# Altium project sinking-clock_Brain-PCB_RigFlex-testPrjPcb.PrjPcb
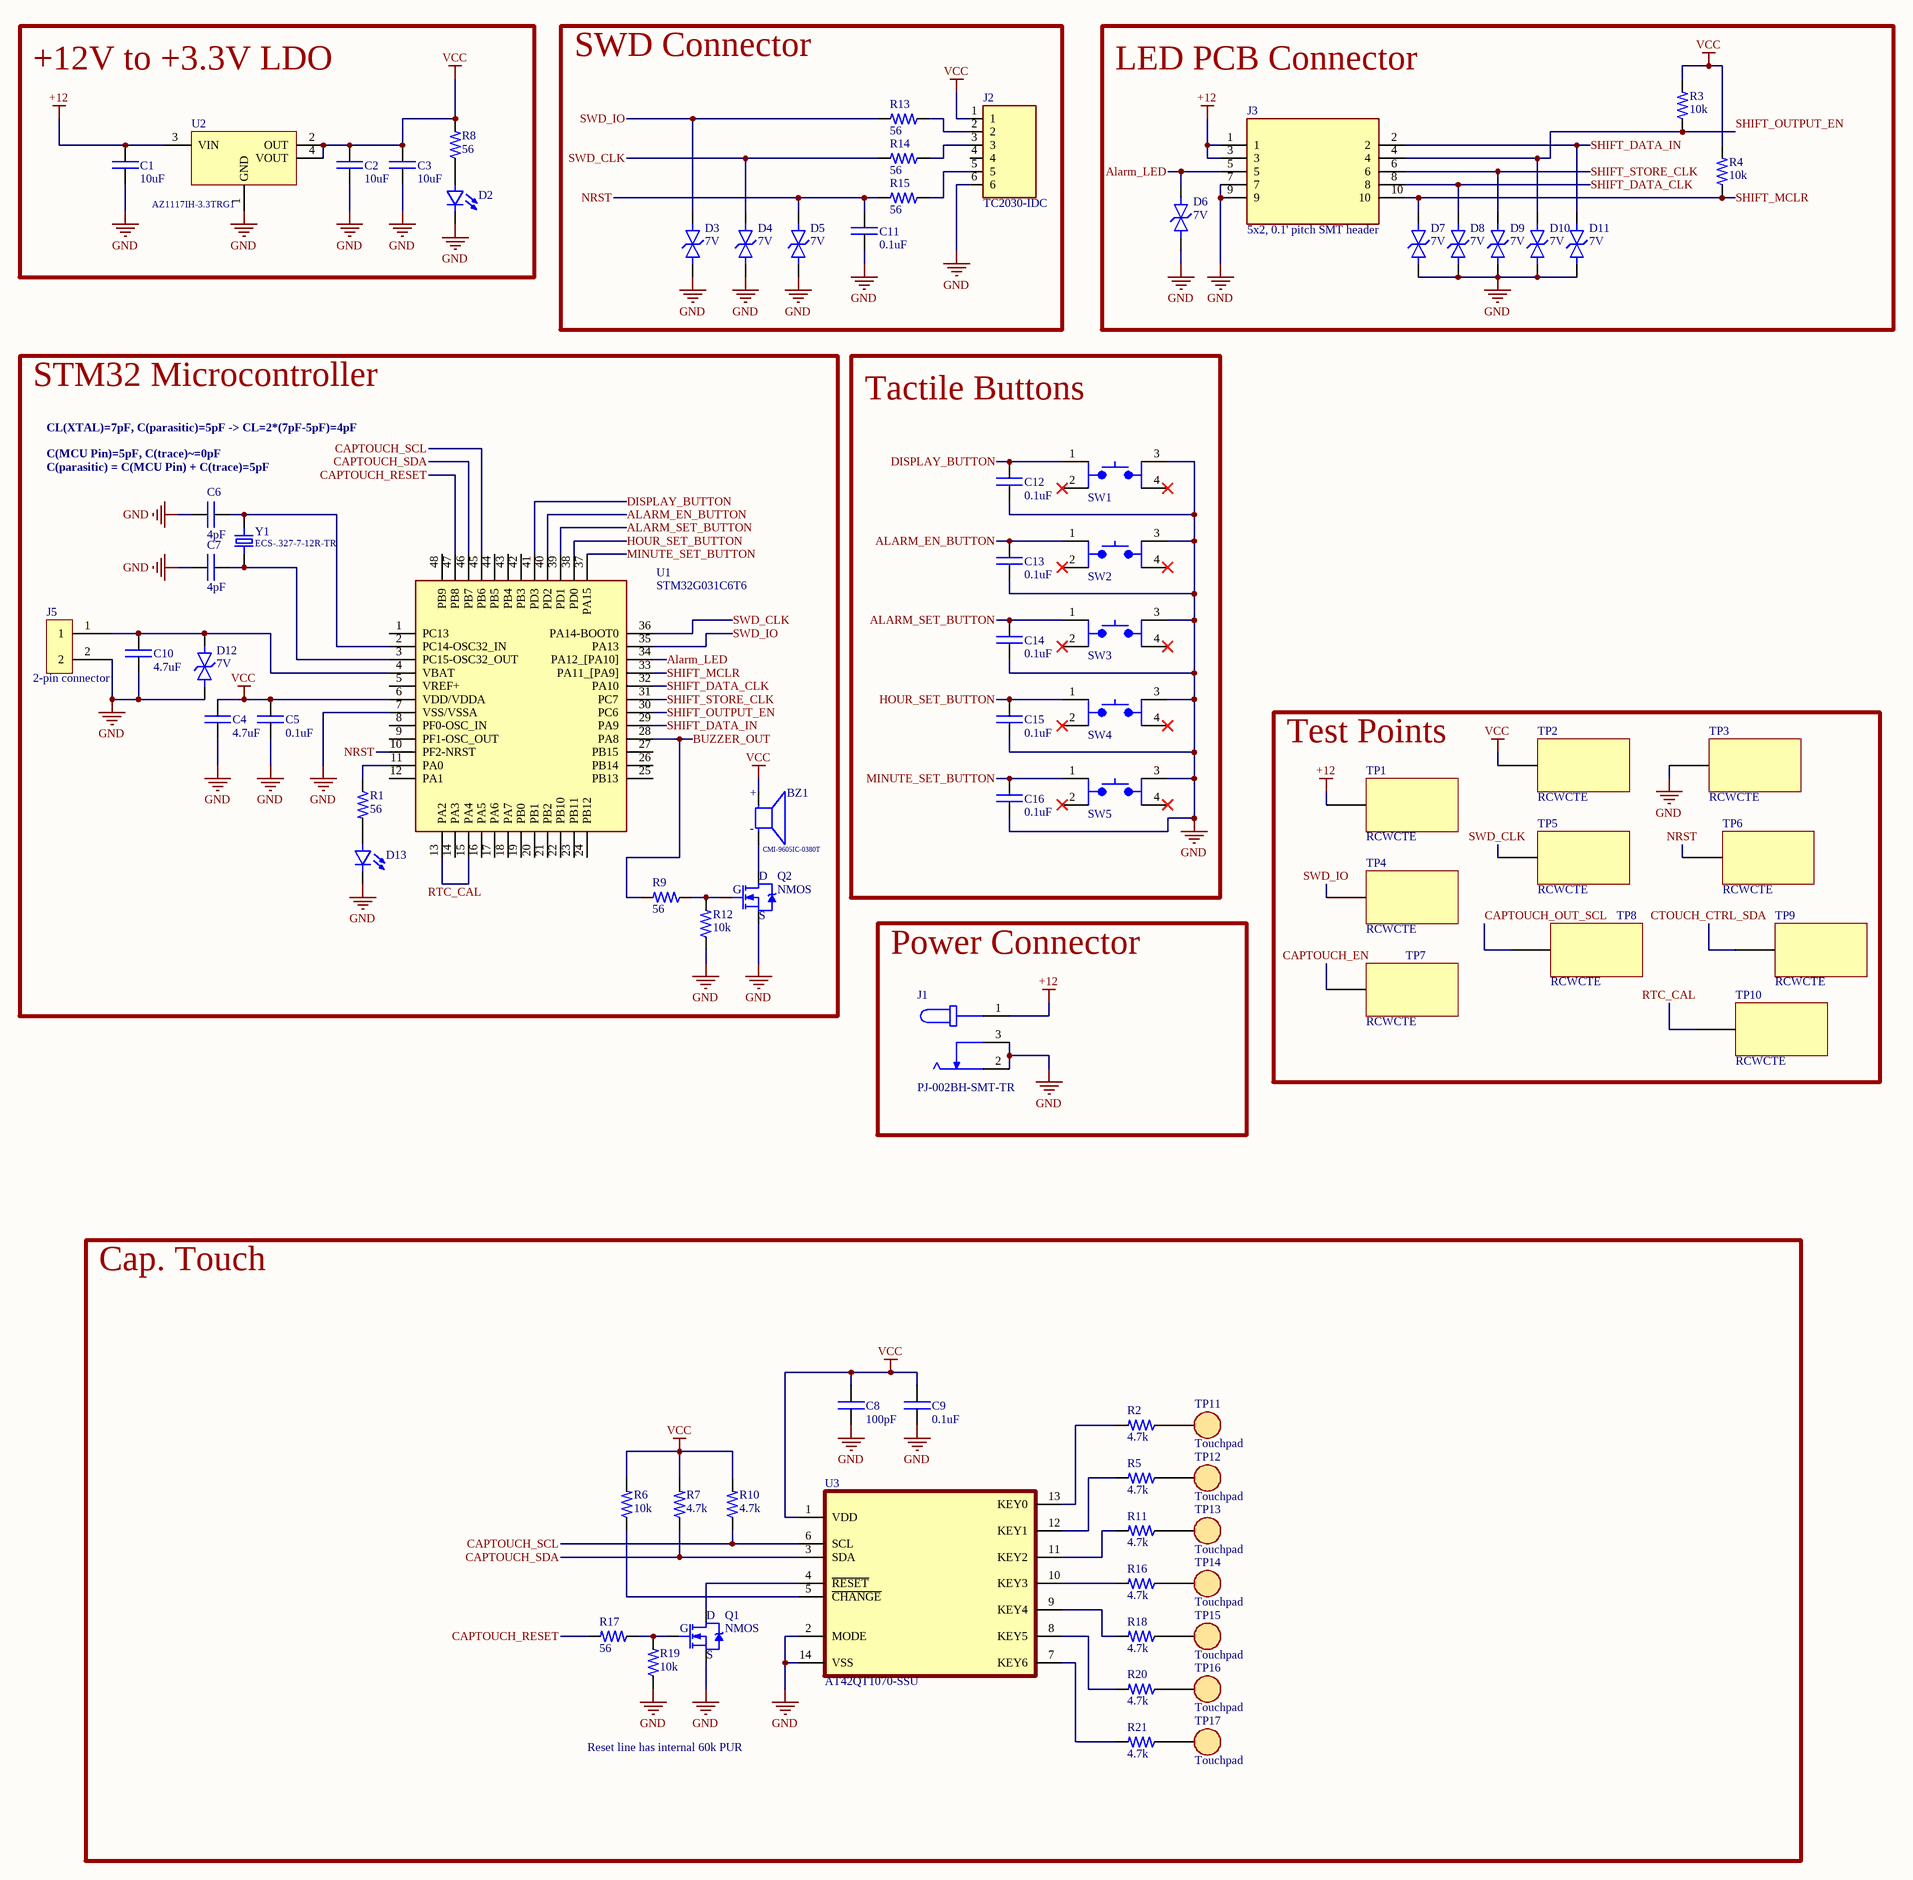
[diagram p0: Brain-PCB_Master_RigFlex-test.SchDoc]
1 sheet, 82 parts. Net scope: global (net labels, ports and power ports of the same name join across sheets).
Board file: sinking-clock_Brain-PCB_RigFlex-test.PcbDoc

## Sheet Brain-PCB_Master_RigFlex-test.SchDoc
size C; SheetNumber: 1; SheetTotal: 1

### Parts
BZ1  CMI-9605IC-0380T  [CUI_CMI-9605IC-0380T]
C1  value 10uF  [0402C]  (hidden comment: CAP)
C2  value 10uF  [0402C]  (hidden comment: CAP)
C3  value 10uF  [0402C]  (hidden comment: CAP)
C4  value 4.7uF  [0402C]  (hidden comment: CAP)
C5  value 0.1uF  [0402C]  (hidden comment: CAP)
C6  value 4pF  [0402C]  (hidden comment: CAP)
C7  value 4pF  [0402C]  (hidden comment: CAP)
C8  value 100pF  [0402C]  (hidden comment: CAP)
C9  value 0.1uF  [0402C]  (hidden comment: CAP)
C10  value 4.7uF  [0402C]  (hidden comment: CAP)
C11  value 0.1uF  [0402C]  (hidden comment: CAP)
C12  value 0.1uF  [0402C]  (hidden comment: CAP)
C13  value 0.1uF  [0402C]  (hidden comment: CAP)
C14  value 0.1uF  [0402C]  (hidden comment: CAP)
C15  value 0.1uF  [0402C]  (hidden comment: CAP)
C16  value 0.1uF  [0402C]  (hidden comment: CAP)
D2  LED - single  [LED - 0603]  (value not drawn)
D3  7V  [DESD3V3S1BL-7B]
D4  7V  [DESD3V3S1BL-7B]
D5  7V  [DESD3V3S1BL-7B]
D6  7V  [DESD3V3S1BL-7B]
D7  7V  [DESD3V3S1BL-7B]
D8  7V  [DESD3V3S1BL-7B]
D9  7V  [DESD3V3S1BL-7B]
D10  7V  [DESD3V3S1BL-7B]
D11  7V  [DESD3V3S1BL-7B]
D12  7V  [DESD3V3S1BL-7B]
D13  LED - single  [LED - 0603]  (value not drawn)
J1  PJ-002BH-SMT-TR  [PJ-002BH-SMT-TR]
J2  TC2030-IDC  [TAG CONNECT TC2030IDC - NO 3D MODEL]
J3  5x2, 0.1' pitch SMT header  [5x2, 0.1' pitch SMT header]
J5  2-pin connector  [2-pos, 0.1" TH header]
Q1  NMOS  [SOT-23]
Q2  NMOS  [SOT-23]
R1  value 56  [0402R]  (hidden comment: RES)
R2  value 4.7k  [0402R]  (hidden comment: RES)
R3  value 10k  [0402R]  (hidden comment: RES)
R4  value 10k  [0402R]  (hidden comment: RES)
R5  value 4.7k  [0402R]  (hidden comment: RES)
R6  value 10k  [0402R]  (hidden comment: RES)
R7  value 4.7k  [0402R]  (hidden comment: RES)
R8  value 56  [0402R]  (hidden comment: RES)
R9  value 56  [0402R]  (hidden comment: RES)
R10  value 4.7k  [0402R]  (hidden comment: RES)
R11  value 4.7k  [0402R]  (hidden comment: RES)
R12  value 10k  [0402R]  (hidden comment: RES)
R13  value 56  [0402R]  (hidden comment: RES)
R14  value 56  [0402R]  (hidden comment: RES)
R15  value 56  [0402R]  (hidden comment: RES)
R16  value 4.7k  [0402R]  (hidden comment: RES)
R17  value 56  [0402R]  (hidden comment: RES)
R18  value 4.7k  [0402R]  (hidden comment: RES)
R19  value 10k  [0402R]  (hidden comment: RES)
R20  value 4.7k  [0402R]  (hidden comment: RES)
R21  value 4.7k  [0402R]  (hidden comment: RES)
SW1  SPDT SMT Tactile Push Button Switch  [TL3301BF160QGTUBE]  (value not drawn)
SW2  SPDT SMT Tactile Push Button Switch  [TL3301BF160QGTUBE]  (value not drawn)
SW3  SPDT SMT Tactile Push Button Switch  [TL3301BF160QGTUBE]  (value not drawn)
SW4  SPDT SMT Tactile Push Button Switch  [TL3301BF160QGTUBE]  (value not drawn)
SW5  SPDT SMT Tactile Push Button Switch  [TL3301BF160QGTUBE]  (value not drawn)
TP1  RCWCTE  [RCWCTE]
TP2  RCWCTE  [RCWCTE]
TP3  RCWCTE  [RCWCTE]
TP4  RCWCTE  [RCWCTE]
TP5  RCWCTE  [RCWCTE]
TP6  RCWCTE  [RCWCTE]
TP7  RCWCTE  [RCWCTE]
TP8  RCWCTE  [RCWCTE]
TP9  RCWCTE  [RCWCTE]
TP10  RCWCTE  [RCWCTE]
TP11  Touchpad
TP12  Touchpad
TP13  Touchpad
TP14  Touchpad
TP15  Touchpad
TP16  Touchpad
TP17  Touchpad
U1  STM32G031C6T6  [48-LQFP]
U2  AZ1117IH-3.3TRG1  [SOT-223-3]
U3  AT42QT1070-SSU  [14-SOIC]
Y1  ECS-.327-7-12R-TR  [ECS-.327-12.5-12R-TR]

### Blocks framed on the sheet
+12V to +3.3V LDO: C1-C3 D2 R8 U2
SWD Connector: C11 D3-D5 J2 R13-R15
LED PCB Connector: D6-D11 J3 R3 R4
STM32 Microcontroller: BZ1 C4-C7 C10 D12 D13 J5 Q2 R1 R9 R12 U1 Y1
Tactile Buttons: C12-C16 SW1-SW5
Test Points: TP1-TP10
Power Connector: J1
Cap. Touch: C8 C9 Q1 R2 R5-R7 R10 R11 R16-R21 TP11-TP17 U3

### Nets
+12: C1.2 J1.1 J3.1 J3.3 TP1.1 U2.3(VIN)
GND: C1.1 C2.1 C3.1 C4.1 C5.1 C6.1 C7.1 C8.1 C9.1 C10.1 C11.1 C12.1 C13.1 C14.1 C15.1 C16.1 D2.2(C) D3.2 D4.2 D5.2 D6.2 D7.2 D8.2 D9.2 D10.2 D11.2 D12.2 D13.2(C) J1.2 J1.3 J2.6 J3.7 J3.9 J5.2 Q1.2(S) Q2.2(S) R12.1 R19.1 SW1.3 SW2.3 SW3.3 SW4.3 SW5.3 TP3.1 U1.7(VSS/VSSA) U2.1(GND) U3.2(MODE) U3.14(VSS)
VCC: BZ1.P C2.2 C3.2 C4.2 C5.2 C8.2 C9.2 J2.1 R3.2 R4.2 R6.2 R7.2 R8.2 R10.2 TP2.1 U1.6(VDD/VDDA) U2.2(OUT) U2.4(VOUT) U3.1(VDD)
ALARM_EN_BUTTON: C13.2 SW2.1 U1.40(PD2)
Alarm_LED: D6.1 J3.5 U1.34(PA12_[PA10])
ALARM_SET_BUTTON: C14.2 SW3.1 U1.39(PD1)
BUZZER_OUT: R9.2 U1.28(PA8)
CAPTOUCH_EN: TP7.1
CAPTOUCH_OUT_SCL: TP8.1
CAPTOUCH_RESET: R17.2 U1.47(PB8)
CAPTOUCH_SCL: R10.1 U1.45(PB6) U3.6(SCL)
CAPTOUCH_SDA: R7.1 U1.46(PB7) U3.3(SDA)
CTOUCH_CTRL_SDA: TP9.1
DISPLAY_BUTTON: C12.2 SW1.1 U1.41(PD3)
HOUR_SET_BUTTON: C15.2 SW4.1 U1.38(PD0)
MINUTE_SET_BUTTON: C16.2 SW5.1 U1.37(PA15)
NRST: C11.2 D5.1 R15.2 TP6.1 U1.10(PF2-NRST)
RTC_CAL: TP10.1 U1.13(PA2) U1.15(PA4)
SHIFT_DATA_CLK: D8.1 J3.8 U1.32(PA10)
SHIFT_DATA_IN: D11.1 J3.2 U1.29(PA9)
SHIFT_MCLR: D7.1 J3.10 R4.1 U1.33(PA11_[PA9])
SHIFT_OUTPUT_EN: D10.1 J3.4 R3.1 U1.30(PC6)
SHIFT_STORE_CLK: D9.1 J3.6 U1.31(PC7)
SWD_CLK: D4.1 R14.2 TP5.1 U1.36(PA14-BOOT0)
SWD_IO: D3.1 R13.2 TP4.1 U1.35(PA13)
NetBZ1_N: BZ1.N Q2.3(D)
NetC6_2: C6.2 U1.2(PC14-OSC32_IN) Y1.2
NetC7_2: C7.2 U1.3(PC15-OSC32_OUT) Y1.1
NetC10_2: C10.2 D12.1 J5.1 U1.4(VBAT)
NetD2_1: D2.1(A) R8.1
NetD13_1: D13.1(A) R1.2
NetJ2_2: J2.2 R13.1
NetJ2_3: J2.3 R14.1
NetJ2_5: J2.5 R15.1
NetQ1_1: Q1.1(G) R17.1 R19.2
NetQ1_3: Q1.3(D) U3.4(~{RESET})
NetQ2_1: Q2.1(G) R9.1 R12.2
NetR1_1: R1.1 U1.11(PA0)
NetR2_1: R2.1 TP11.1
NetR2_2: R2.2 U3.13(KEY0)
NetR5_1: R5.1 TP12.1
NetR5_2: R5.2 U3.12(KEY1)
NetR6_1: R6.1 U3.5(~{CHANGE})
NetR11_1: R11.1 TP13.1
NetR11_2: R11.2 U3.11(KEY2)
NetR16_1: R16.1 TP14.1
NetR16_2: R16.2 U3.10(KEY3)
NetR18_1: R18.1 TP15.1
NetR18_2: R18.2 U3.9(KEY4)
NetR20_1: R20.1 TP16.1
NetR20_2: R20.2 U3.8(KEY5)
NetR21_1: R21.1 TP17.1
NetR21_2: R21.2 U3.7(KEY6)

Not connected (* = marked no-connect by the designer): J2 4; SW1 2* 4*; SW2 2* 4*; SW3 2* 4*; SW4 2* 4*; SW5 2* 4*; U1 1(PC13) 5(VREF+) 8(PF0-OSC_IN) 9(PF1-OSC_OUT) 12(PA1) 14(PA3) 16(PA5) 17(PA6) 18(PA7) 19(PB0) 20(PB1) 21(PB2) 22(PB10) 23(PB11) 24(PB12) 25(PB13) 26(PB14) 27(PB15) 42(PB3) 43(PB4) 44(PB5) 48(PB9)

### Notes on the sheet
- CL(XTAL)=7pF, C(parasitic)=5pF -> CL=2*(7pF-5pF)=4pF
- C(MCU Pin)=5pF, C(trace)~=0pF
- C(parasitic) = C(MCU Pin) + C(trace)=5pF
- Reset line has internal 60k PUR
- (in symbol CMI-9605IC-0380T) +; -

### Library data of the parts
BZ1 = CMI-9605IC-0380T: MAGNETIC BUZZER INDICATOR; MFR: CUI Devices; Vendor: DigiKey; Vendor PN: 2223-CMI-9605IC-0380T-ND; MFR PN: CMI-9605IC-0380T; Vendor Link: https://www.digikey.com/en/products/detail/cui-devices/CMI-9605IC-0380T/11674180
C1-C3 = CAP: Capaicitor; MFR: KYOCERA AVX; MFR PN: KGM05CR51A106MH; Vendor: DigiKey; Vendor PN: 478-KGM05CR51A106MHCT-ND; ClassName: PWR; Vendor Link: https://www.digikey.com/en/products/detail/kyocera-avx/KGM05CR51A106MH/6564275
C4 C10 = CAP: Capaicitor; MFR: Samsung Electro-Mechanics; MFR PN: CL05A475KQ5NRNC; Vendor: DigiKey; Vendor PN: 1276-6796-1-ND; Vendor Link: https://www.digikey.com/en/products/detail/samsung-electro-mechanics/CL05A105KL5NRNC/5961280
C5 C9 C11-C16 = CAP: Capaicitor; MFR: Samsung Electro-Mechanics; MFR PN: CL05A104KP5NNNC; Vendor: DigiKey; Vendor PN: 1276-1022-1-ND; Vendor Link: https://www.digikey.com/en/products/detail/samsung-electro-mechanics/CL05A104KP5NNNC/3886680
C6-C8 = CAP: Capaicitor
D2 D13 = LED - single: LED; MFR: Dialight; MFR PN: 5988070107F; Color: Green; Vendor: DigiKey; Vendor PN: 350-2035-1-ND; Vendor Link: https://www.digikey.com/en/products/detail/dialight/5988070107F/1291269; ClassName: PWR
D3-D12 = TVS Diode Bi: MFR PN: DESD3V3E1BL-7B; MFR: Diodes Incorporated
J1 = PJ-002BH-SMT-TR: 2.5 mm Center Pin, 5.0 A, Right Angle, Surface Mount (SMT), Dc Power Jack Connector; MFR: CUI Devices; Vendor: DigiKey; Vendor PN: CP-002BHPJCT-ND; ClassName: PWR; MFR PN: PJ-002BH-SMT-TR; Vendor Link: https://www.digikey.com/en/products/detail/cui-devices/PJ-002BH-SMT-TR/404626
J2 = TC2030-IDC: "Plug of Nails" POGO Pin connector; MFR PN: TC2030-IDC-NL; MFR: Tag-Connect
J3 = 5x2, 0.1' pitch SMT header: CONN HEADER SMD 10POS 2.54MM; MFR: CNC Tech; MFR PN: 3020-10-0300-00; Vendor: DigiKey; Vendor PN: 1175-1621-ND; Vendor Link: https://www.digikey.com/en/products/detail/cnc-tech/3020-10-0300-00/3441727
J5 = 2-pin connector: 2-pos connector, 0.1", TH, male; Value: DNS; MFR: *; MFR PN: *; Vendor: *; Vendor PN: *; Vendor Link: *
Q1 Q2 = NMOS: N-Channel MOSFET; MFR PN: DMN63D8L; MFR: Diodes Incorporated; Vendor: *; Vendor PN: *; Vendor Link: *
R1 R8 R9 R13-R15 R17 = RES: Resistor; MFR: YAGEO; MFR PN: RC0402FR-0756RL; Vendor: DigiKey; Vendor PN: 311-56.0LRCT-ND; ClassName: PWR; Vendor Link: https://www.digikey.com/en/products/detail/yageo/RC0402FR-0756RL/726636
R2 R5 R7 R10 R11 R16 R18 R20 R21 = RES: Resistor; MFR PN: AC0402FR-134K7L; MFR: YAGEO; Vendor: *; Vendor PN: *; Vendor Link: *
R3 R4 R6 R12 R19 = RES: Resistor; MFR: YAGEO; MFR PN: RC0402JR-0710KL; Vendor: DigiKey; Vendor PN: 311-10KJRCT-ND; Vendor Link: https://www.digikey.com/en/products/detail/yageo/RC0402JR-0710KL/726418
SW1-SW5 = SPDT SMT Tactile Push Button Switch: Tactile Push Button Switch, Gull Wing Lead, 9.5mm contact height; MFR: E-Switch; MFR PN: TL3301BF160QG; Vendor: DigiKey; Vendor PN: 141-TL3301BF160QGTUBE-ND; Vendor Link: https://www.digikey.com/en/products/detail/e-switch/TL3301BF160QGTUBE/1805543
TP1-TP10 = Test Point: Test Point, Surface Mount; MFR: KOA Speer Electronics, Inc.; Vendor: DigiKey; Vendor PN: 2019-RCWCTECT-ND; MFR PN: RCWCTE; Vendor Link: https://www.digikey.com/en/products/detail/koa-speer-electronics-inc/RCWCTE/11476558
  TP1 TP2: ClassName: PWR
  TP7-TP9: ClassName: CTOUCH
U1 = STM32G031C6T6: STM32G031C6T6 - ARM MCU, STM32 Family STM32G0 Series Microcontrollers, ARM Cortex-M0+, 32bit, 64 MHz, 32 KB, 8 KB; MFR: STMicroelectronics; Vendor: DigiKey; Vendor PN: 497-19555-ND; MFR PN: STM32G031C6T6; Vendor Link: https://www.digikey.com/en/products/detail/stmicroelectronics/STM32G031C6T6/10300268
U2 = AZ1117IH-3.3TRG1: IC REG LINEAR 3.3V 1A SOT223; MFR: Diodes Incorporated; Vendor: DigiKey; Vendor PN: AZ1117IH-3.3TRG1DICT-ND; ClassName: PWR; MFR PN: AZ1117IH-3.3TRG1; Vendor Link: https://www.digikey.com/en/products/detail/diodes-incorporated/AZ1117IH-3-3TRG1/5699672
U3 = AT42QT1070-SSU: Capacitive Touch Buttons 14-SOIC; MFR: Microchip; Value: *; MFR PN: AT42QT1070-SSU
Y1 = ECS-.327-7-12R-TR: SMD Tuning Fork Crystal; MFR: ECS Inc.; Vendor: DigiKey; Vendor PN: XC2743CT-ND; MFR PN: ECS-.327-7-12R-TR; Vendor Link: https://www.digikey.com/en/products/detail/ecs-inc/ECS-327-7-12R-TR/8593599